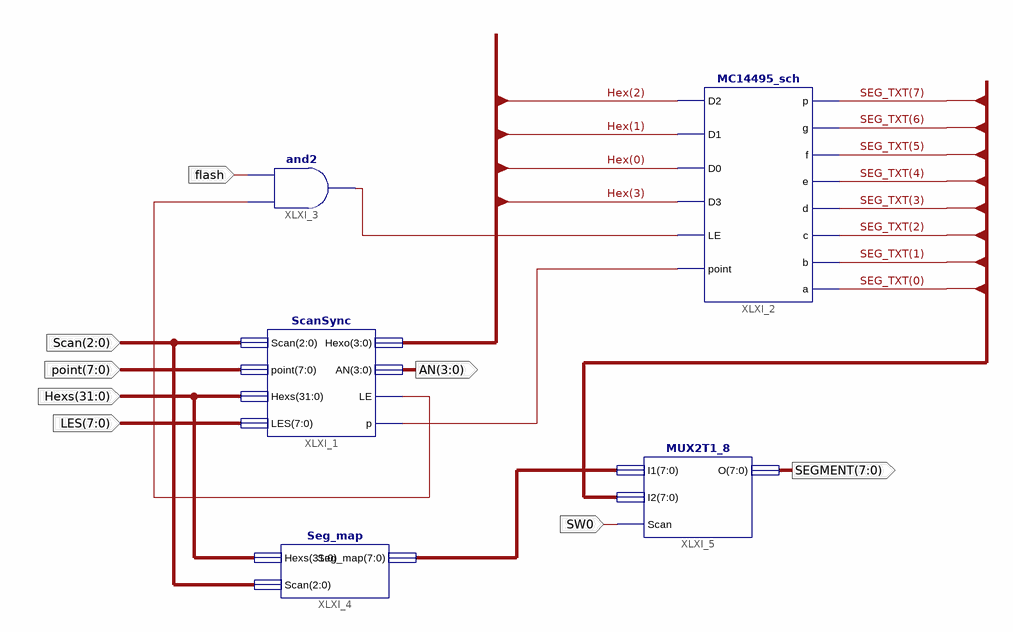
[diagram p0: schematic sheet 1]
// Xilinx ISE schematic Seg7_Dev.sch (kintex7) as structural Verilog: 5 symbols, 8 ports
module Seg7_Dev (
  input  flash,
  input  [2:0] Scan,
  input  [31:0] Hexs,
  input  [7:0] point,
  input  [7:0] LES,
  input  SW0,
  output [3:0] AN,
  output [7:0] SEGMENT
);

  wire XLXN_3, XLXN_4, XLXN_7;
  wire [3:0] Hex;
  wire [7:0] SEG_TXT, XLXN_29;

  ScanSync XLXI_1 (.Scan(Scan), .point(point), .Hexs(Hexs), .LES(LES), .Hexo(Hex), .AN(AN), .LE(XLXN_4), .p(XLXN_7));
  MC14495_sch XLXI_2 (
    .D2(Hex[2]), .D1(Hex[1]), .D0(Hex[0]), .LE(XLXN_3), .point(XLXN_7), .D3(Hex[3]), .p(SEG_TXT[7]),
    .g(SEG_TXT[6]), .f(SEG_TXT[5]), .e(SEG_TXT[4]), .d(SEG_TXT[3]), .c(SEG_TXT[2]), .b(SEG_TXT[1]),
    .a(SEG_TXT[0]));
  and XLXI_3 (XLXN_3, XLXN_4, flash);
  Seg_map XLXI_4 (.Hexs(Hexs), .Scan(Scan), .Seg_map(XLXN_29));
  MUX2T1_8 XLXI_5 (.I1(XLXN_29), .I2(SEG_TXT), .Scan(SW0), .O(SEGMENT));
endmodule
